# EasyEDA Pro project ProPrj_电路原理图和PCB图1_2024-08-20.epro

# Schematic Schematic2_1
Board Name: Board2_1; Create Date: 2024-08-20; Page Name: P1_1; Project Name: 电路原理图和PCB图1; Schematic Name: Schematic2_1; Update Date: 2024-08-20
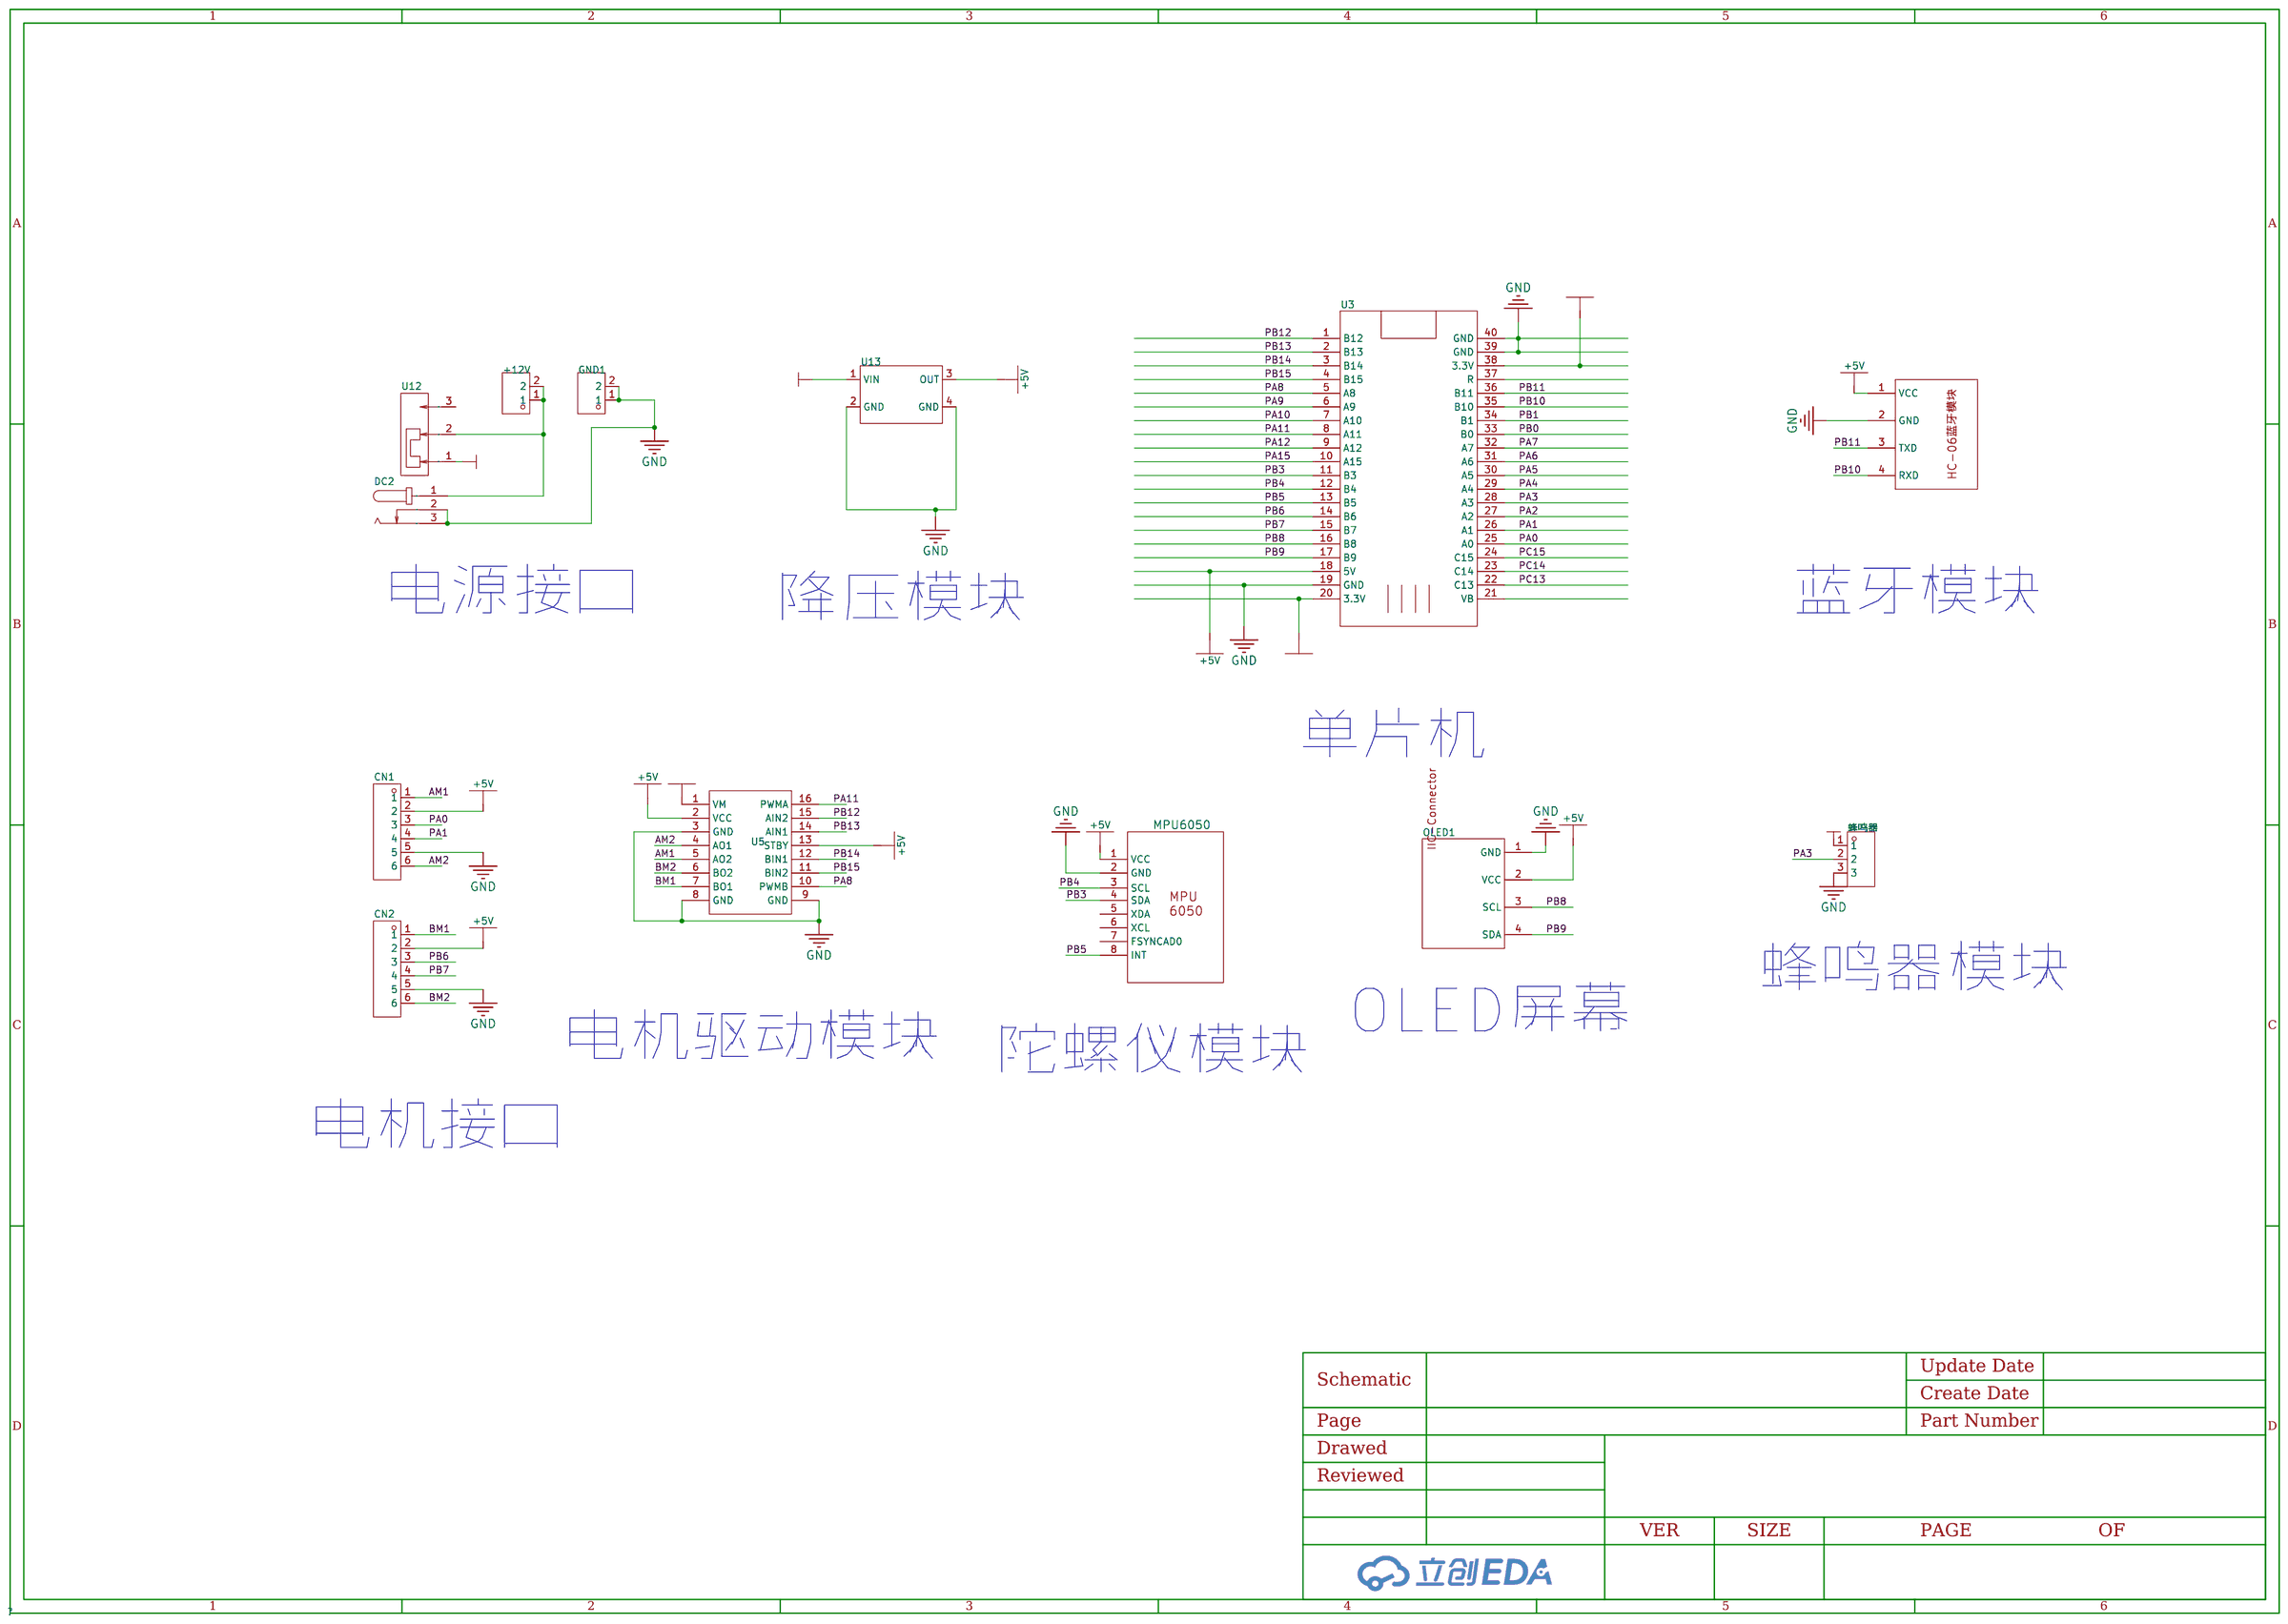
[diagram p0: schematic sheet]

## Parts
+12V  -  [HDR-TH_2P-P2.54-V]
CN1  PH2.0-6P  [PH2.0-6P 直针端子座]
CN2  PH2.0-6P  [PH2.0-6P 直针端子座]
DC2  -  [DC-IN-TH_KH-DC-005-2.5]
GND1  -  [HDR-TH_2P-P2.54-V]
OLED1  -  [0.96OLED_4P]
P1  MPU6050  [MPU6050]
U3  -  [STM32F103C8T6核心板]
U5  -  [TB6612FNG Module - 8pin x 2]
U6  蓝牙模块HC-06  [DIP-1X4P2.54（HC-06蓝牙模块）]
U12  SS-12D10-G5  [SW-TH_SS-12D10-G050]
U13  -  [MP1584模块]
蜂鸣器  -  [HDR-TH_3P-P2.54-V-F]

## Library data of the parts
+12V GND1 = 排针2P: 2.54 1*2P 直排针 0.8u镀金 PBT RoHS,针长3*6mm; Supplier Part: C152154; Manufacturer: Nextron(台湾正凌); Manufacturer Part: Z-211-0211-0021-001; LCSC On Sale: 1; Supplier Footprint: Through Hole,P=2.54mm; JLCPCB Part Class: Extended Part; JLCPCB Stock Number: 5280; Datasheet: https://atta.szlcsc.com/upload/public/pdf/source/20171225/C152154_15141883746031203216.pdf; Supplier: LCSC; Number of Positions: 2; Connector Type: 排针; Number of Rows: 1; Mounting Type: 通孔; Contact Type: 公形引脚; Pitch: 0.100; Contact Material: 黄铜
CN1 CN2 = PH2.0-6P: Pin Type: IN; Supplier: LCSC; Supplier Part: C722763; Manufacturer: CAX(创都); Manufacturer Part: PH2.0-4P; JLCPCB Part Class: Extended Part
DC2 = KH-DC-005-2.5: 连接器类型:DC电源插座;安装方式:弯插;触点内径:-;触点外径:6.4mm;额定电流:1A;额定电压:30V;工作温度范围:-25~+70;; LCSC Part Name: DC电源插座 外径:6.4mm; Supplier Part: C2847170; Manufacturer: kinghelm(金航标); Supplier Footprint: 插件; JLCPCB Part Class: Extended Part; Datasheet: https://atta.szlcsc.com/upload/public/pdf/source/20210716/C2847170_7F0110A0BEDEE81C68B76DF87AC8DA16.pdf; Supplier: LCSC; Connector Type: DC电源插座; Mounting Style: 弯插; Outside Contact Diameter: 6.4mm; Current Rating (Max): 1A; Voltage Rating (Max): 30V; Operating Temperature Range: -25~+70
OLED1 = 0.96OLED_4P: LCSC Part Name: 0.96OLED_4P_MODULE_JX; Supplier Part: C9900004566; Manufacturer Part: 0.96OLED_4P_MODULE_JX; Supplier Footprint: THrough hole; JLCPCB Part Class: Extended Part; Supplier: LCSC
P1 = MPU6050
U3 = stm32f103c8t6最小系统板
U5 = TB6612FNG模块: Pin Type: In
U6 = 蓝牙模块HC-06: Pin Type: IN
U12 = SS-12D10-G5: 电路结构:单刀双掷;安装方式:直插;开关颜色:黑色;滑钮形状:矩形柱状;引脚样式:PC引脚;开关长度:12.7mm;开关宽度:6.7mm;开关高度:11.3mm;; LCSC Part Name: 插件大电流拨动开关; Supplier Part: C2998777; Manufacturer: DEALON(德艺隆); Supplier Footprint: 插件; JLCPCB Part Class: Extended Part; Datasheet: https://atta.szlcsc.com/upload/public/pdf/source/20220428/E10CB334ACBAF32CF4AF8D87DA871CD3.pdf; Supplier: LCSC; Circuit: 单刀双掷; Mounting Style: 直插; Actuator Color: 黑色; Actuator Style: 矩形柱状; Pin Style: PC引脚; Switch Length: 12.7mm; Switch Width: 6.7mm; Switch Height: 11.3mm
U13 = MP1584模块: Pin Type: IN
蜂鸣器 = HDR-F_2.54_1x3P: Supplier Part: C541850; Supplier Footprint: 插件

## Nets
+3.3V: U3.20(3.3V) U3.38(3.3V)
+5V: CN1.2 CN2.2 OLED1.2(VCC) P1.1(VCC) U3.18(5V) U5.2(VCC) U5.13(STBY) U6.1(VCC) U13.3(OUT) 蜂鸣器.1
+12V: U5.1(VM) U12.1 U13.1(VIN)
GND: CN1.5 CN2.5 DC2.2 DC2.3 GND1.1 GND1.2 OLED1.1(GND) P1.2(GND) U3.19(GND) U3.39(GND) U3.40(GND) U5.3(GND) U5.8(GND) U5.9(GND) U6.2(GND) U13.2(GND) U13.4(GND) 蜂鸣器.3
AM1: CN1.1 U5.5(AO2)
AM2: CN1.6 U5.4(AO1)
BM1: CN2.1 U5.7(BO1)
BM2: CN2.6 U5.6(BO2)
PA0: CN1.3 U3.25(A0)
PA1: CN1.4 U3.26(A1)
PA2: U3.27(A2)
PA3: U3.28(A3) 蜂鸣器.2
PA4: U3.29(A4)
PA5: U3.30(A5)
PA6: U3.31(A6)
PA7: U3.32(A7)
PA8: U3.5(A8) U5.10(PWMB)
PA9: U3.6(A9)
PA10: U3.7(A10)
PA11: U3.8(A11) U5.16(PWMA)
PA12: U3.9(A12)
PA15: U3.10(A15)
PB0: U3.33(B0)
PB1: U3.34(B1)
PB3: P1.4(SDA) U3.11(B3)
PB4: P1.3(SCL) U3.12(B4)
PB5: P1.8(INT) U3.13(B5)
PB6: CN2.3 U3.14(B6)
PB7: CN2.4 U3.15(B7)
PB8: OLED1.3(SCL) U3.16(B8)
PB9: OLED1.4(SDA) U3.17(B9)
PB10: U3.35(B10) U6.4(RXD)
PB11: U3.36(B11) U6.3(TXD)
PB12: U3.1(B12) U5.15(AIN2)
PB13: U3.2(B13) U5.14(AIN1)
PB14: U3.3(B14) U5.12(BIN1)
PB15: U3.4(B15) U5.11(BIN2)
PC13: U3.22(C13)
PC14: U3.23(C14)
PC15: U3.24(C15)
$3N3363: +12V.1 +12V.2 DC2.1 U12.2

Not connected (* = marked no-connect by the designer): P1 5(XDA) 6(XCL) 7(FSYNCAD0); U3 21(VB) 37(R); U12 3

## Notes on the sheet
- 电源接口
- 降压模块
- 蓝牙模块
- 单片机
- 蜂鸣器模块
- OLED屏幕
- 电机驱动模块
- 陀螺仪模块
- 电机接口

# Board 标准版
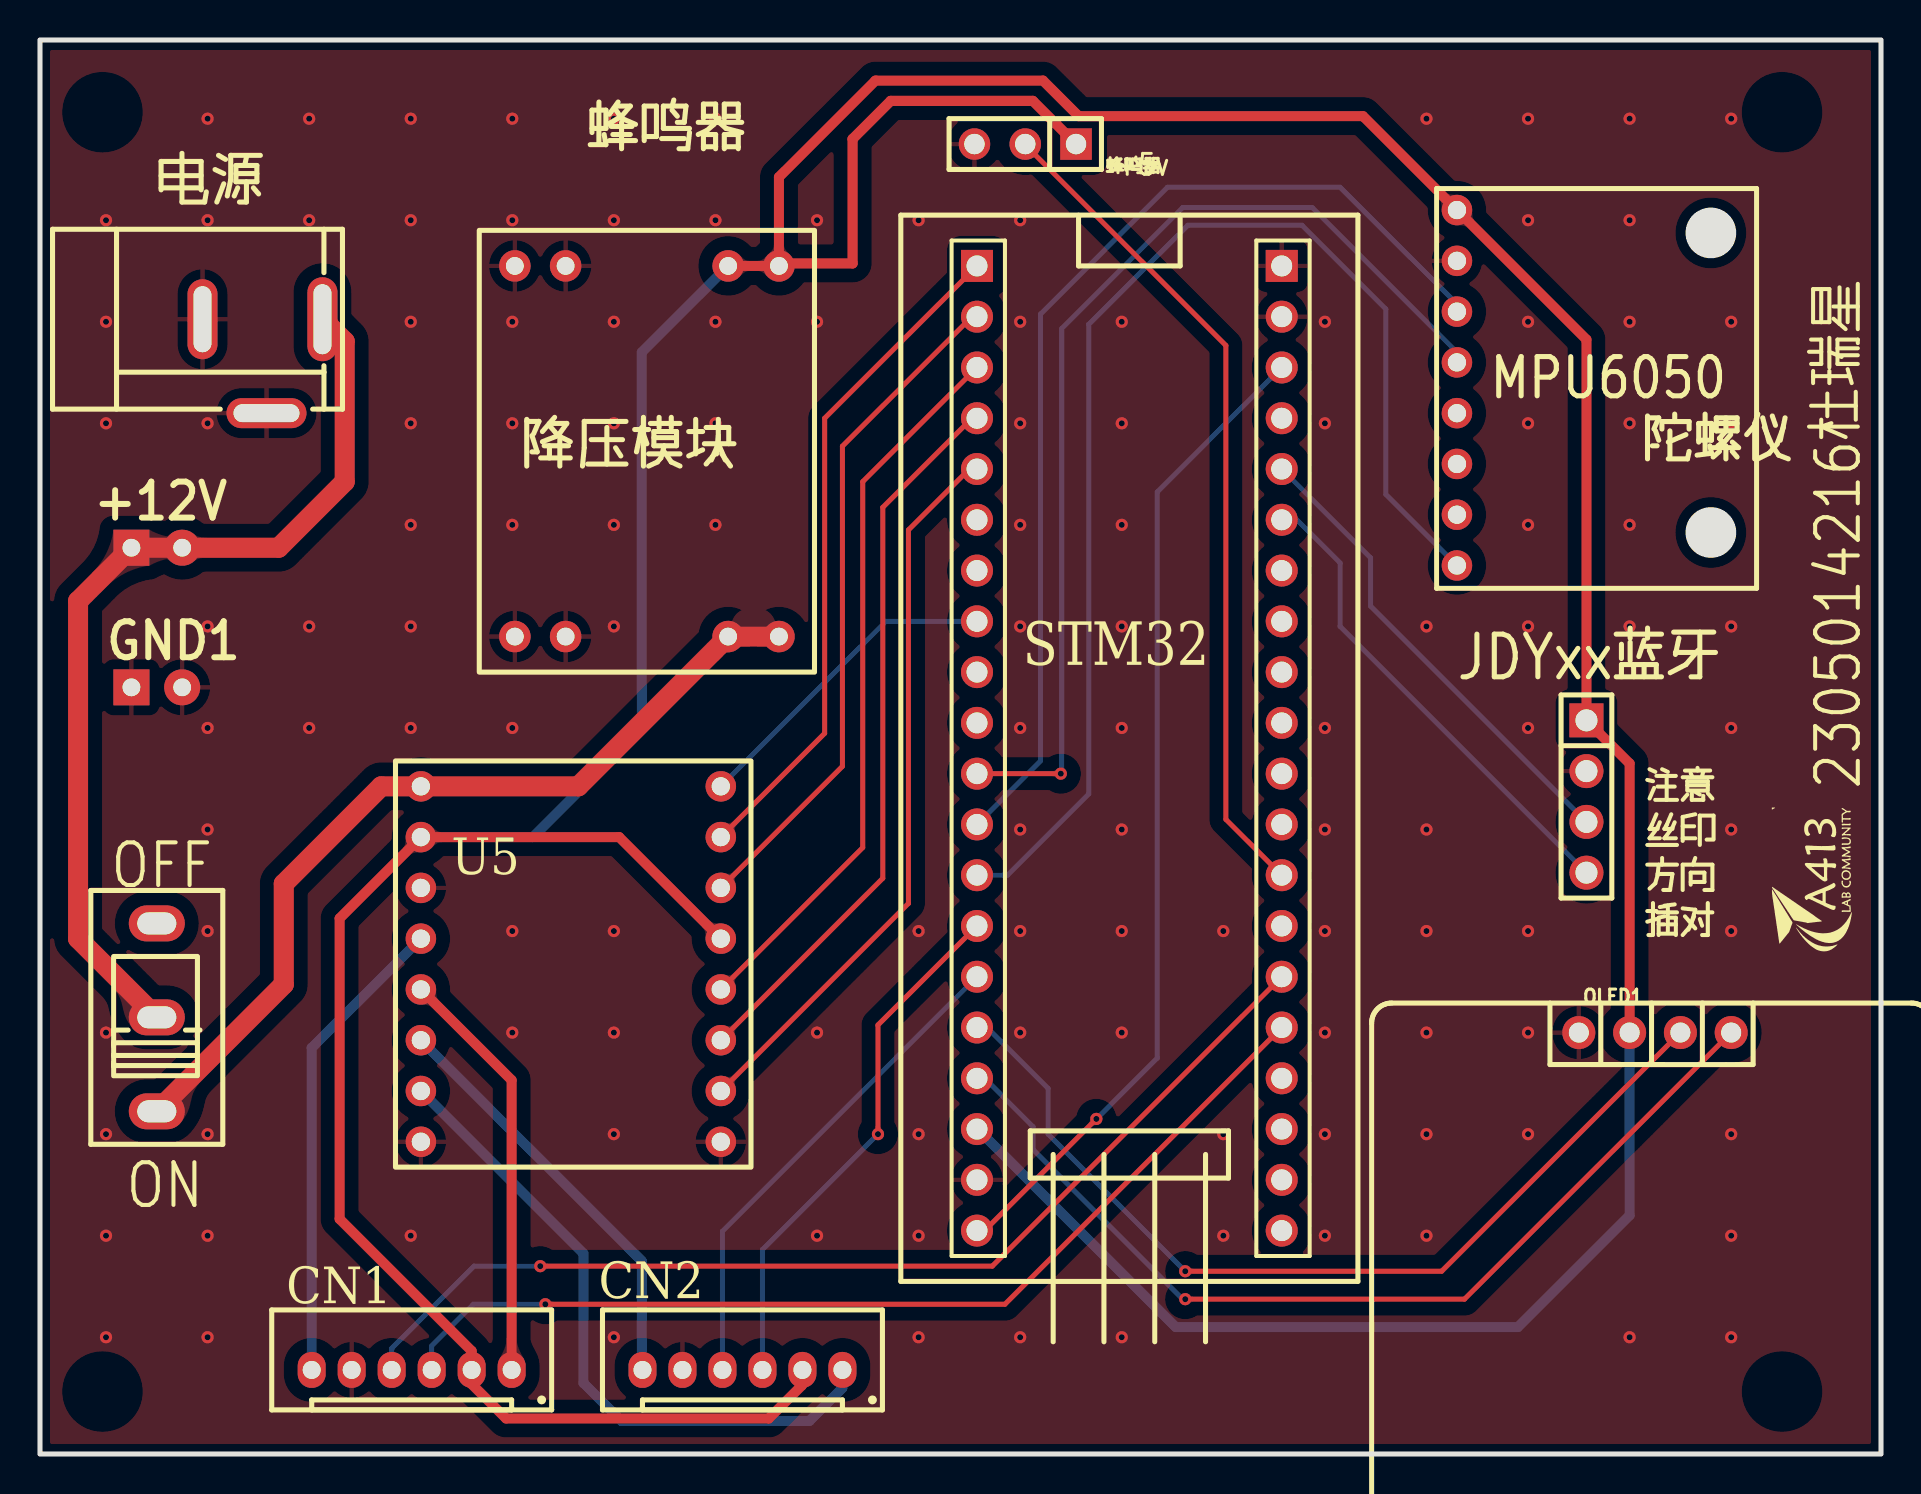
[diagram p1: board, top side]
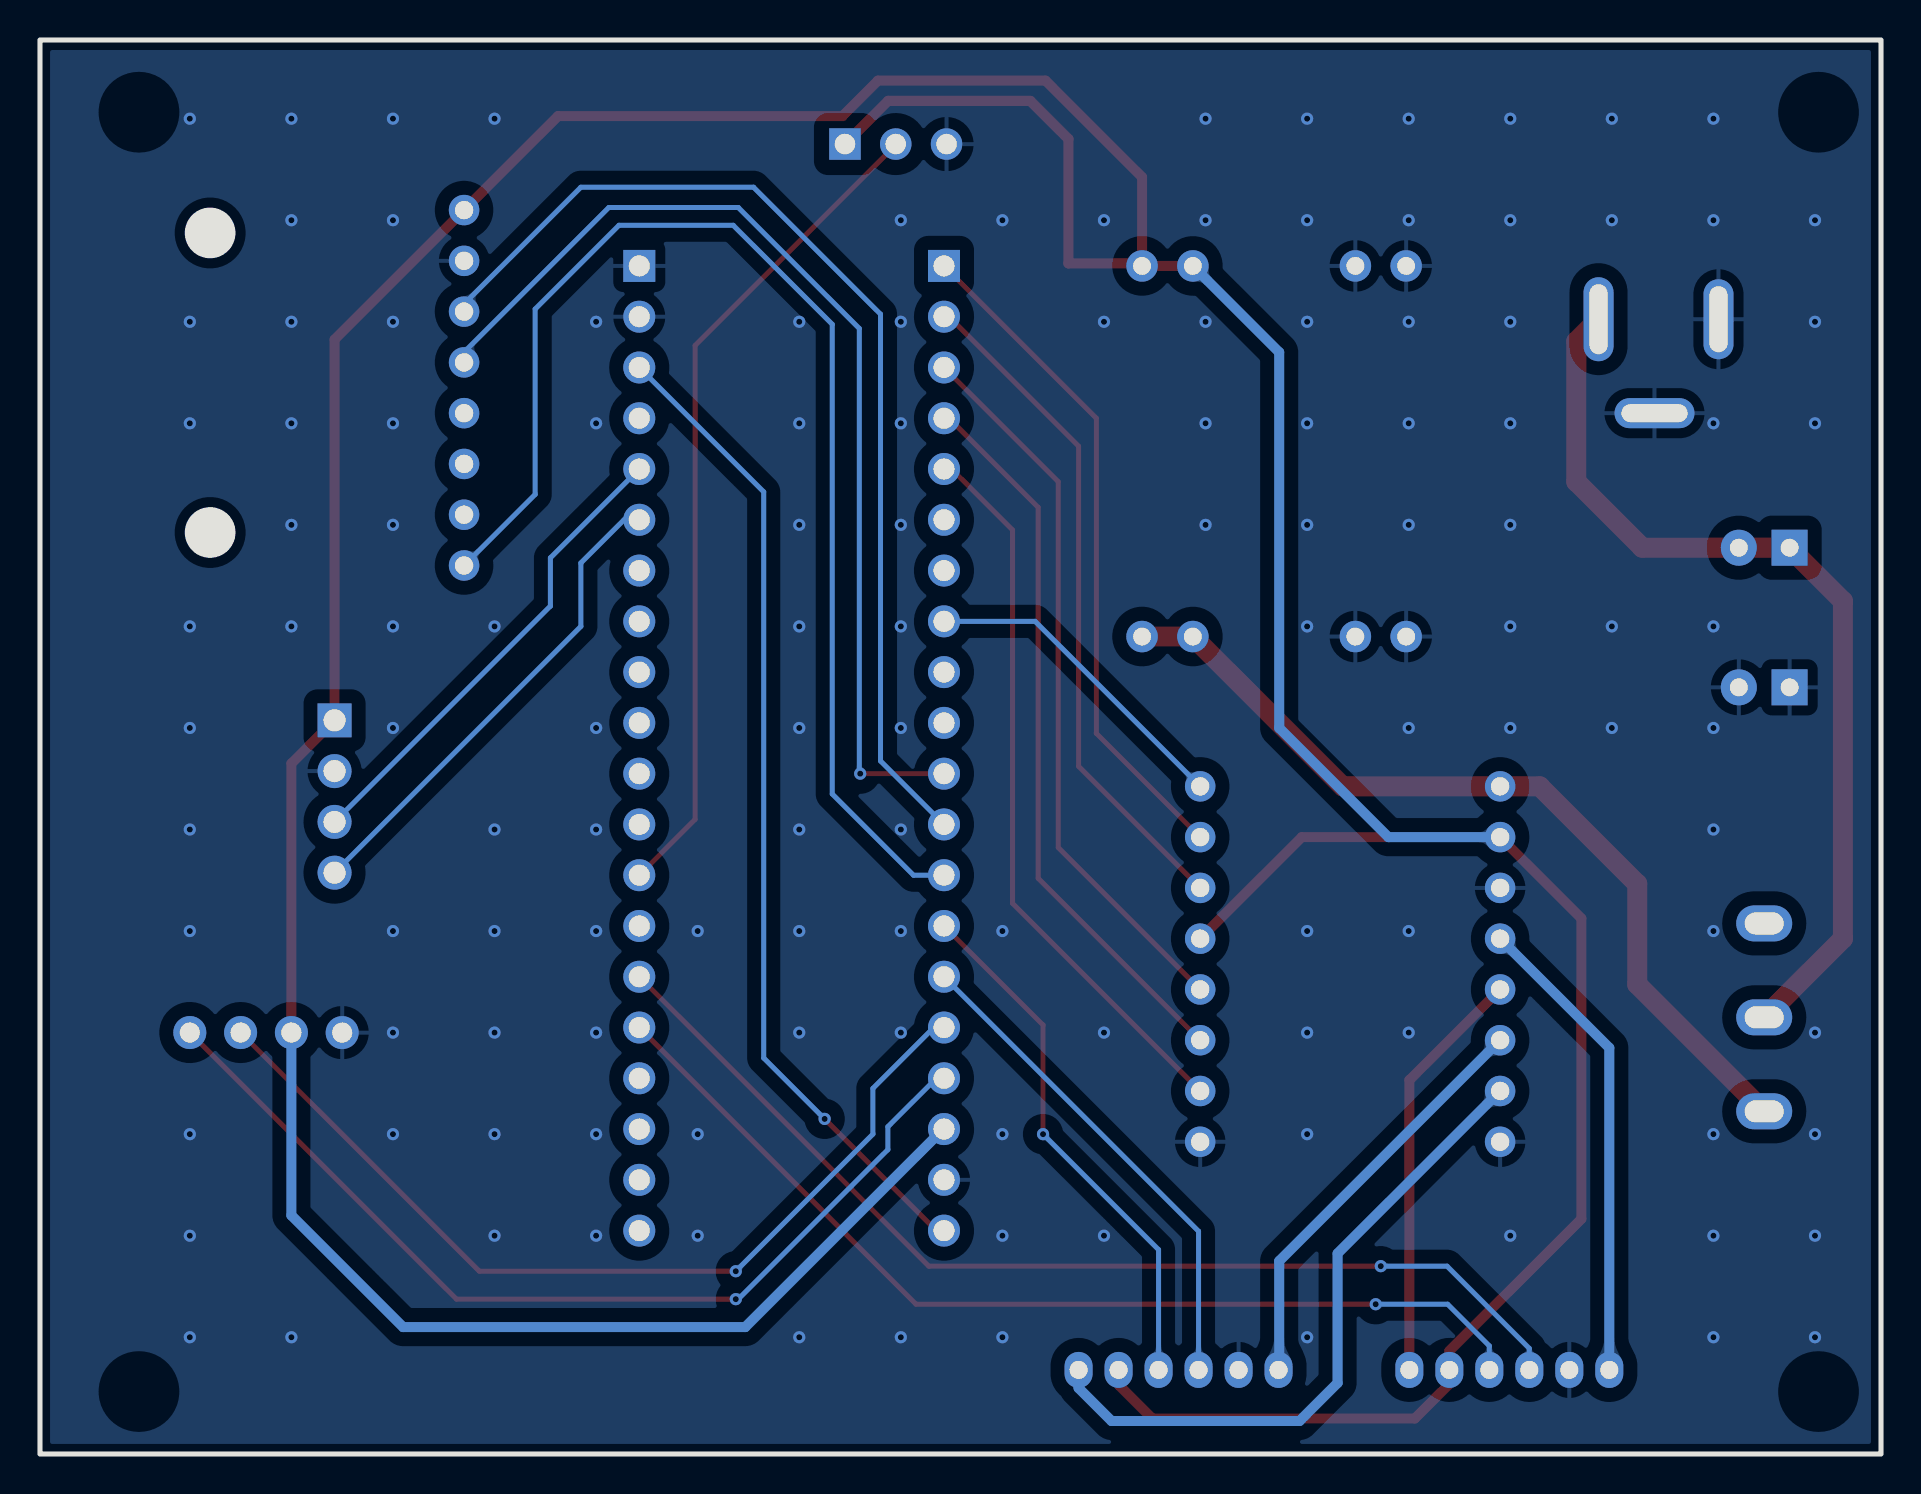
[diagram p2: board, bottom side, seen from below]

Outline 92.07 x 70.74 mm; copper layers: Top Layer, Bottom Layer. Coordinates in mm from the lower left corner of the outline.
Outline path: rectangle 0,70.74 92.07,0
Stack: Top Layer 0.035mm / Dielectric1 1.51mm FR4 er 4.5 / Bottom Layer 0.035mm

## Design rules (mm)
spacing safeClearance (default): track to track 0.152, other pairs 0.152 to 0.3
track width trackWidth (default): min 0.127, default 0.254, max 2.54
differential pair differentialPair (default): width min 0.127, default 0.254, max 2.54; gap min 0.152, default 0.152
via viaSize (default): diameter min 0.5, default 0.61, max 10; hole min 0.3, default 0.305, max 6
template: 用户自定义配置
spacing safeClearance (default): track to track 0.5, other pairs 0.5 to 0.5
track width trackWidth (default): min 0.127, default 0.254, max 2.54
differential pair differentialPair (default): width min 0.127, default 0.254, max 2.54; gap min 0.152, default 0.152
via viaSize (default): diameter min 0.5, default 0.61, max 10; hole min 0.3, default 0.305, max 6

## Placement (name value [footprint] x y rotation side)
+12V  -  [HDR-TH_2P-P2.54-V]  5.84 45.34 0 top
CN1  PH2.0-6P  [PH2.0-6P 直针端子座]  23.59 4.21 180 top
CN2  PH2.0-6P  [PH2.0-6P 直针端子座]  40.13 4.21 180 top
DC2  -  [DC-IN-TH_KH-DC-005-2.5]  11.13 54.42 0 top
GND1  -  [HDR-TH_2P-P2.54-V]  5.84 38.35 0 top
OLED1  -  [0.96OLED_4P]  80.77 21.08 0 top
P1  -  [MPU6050]  69.85 43.31 0 top
U3  -  [STM32F103C8T6核心板]  54.48 35.31 0 top
U5  -  [TB6612FNG Module - 8pin x 2]  26.67 24.51 0 top
U6  蓝牙模块HC-06  [DIP-1X4P2.54（HC-06蓝牙模块）]  77.34 32.89 180 top
U12  SS-12D10-G5  [SW-TH_SS-12D10-G050]  5.84 21.84 90 top
U13  -  [MP1584模块]  30.35 50.17 90 top
蜂鸣器  -  [HDR-TH_3P-P2.54-V-F]  49.28 65.53 180 top

## Footprints (pads in the part's own frame, mm; a bottom-side part is the same pattern mirrored in y, then rotated)
0.96OLED_4P
  round 1.651 hole 1.001: 1(-3.81,0) 2(-1.27,0.003) 3(1.27,0.003) 4(3.81,0.003)
DC-IN-TH_KH-DC-005-2.5
  oval 1.501x4.201 hole 0.899x3.5: 1(2.999,2.349)
  oval 1.501x4 hole 0.899x3.3: 2(-2.999,2.349)
  oval 4x1.501 hole 3.3x0.899: 3(0.201,-2.349)
DIP-1X4P2.54（HC-06蓝牙模块）
  rect 1.7x1.7 hole 1.1: 1(0,-3.81)
  round 1.7 hole 1.1: 2(0,-1.27) 3(0,1.27) 4(0,3.81)
HDR-TH_2P-P2.54-V
  rect 1.801x1.801 hole 0.889: 1(-1.27,0)
  round 1.801 hole 0.889: 2(1.27,0)
HDR-TH_3P-P2.54-V-F
  rect 1.575x1.575 hole 1.02: 1(-2.54,0)
  round 1.575 hole 1.02: 2(0,0) 3(2.54,0)
MP1584模块
  round 1.575 hole 0.889: 1(-9.271,-4.064) 1(-9.271,-6.604) 2(-9.271,6.604) 2(-9.271,4.064) 3(9.271,-4.064) 3(9.271,-6.604) 4(9.271,6.604) 4(9.271,4.064)
MPU6050
  round 1.524 hole 0.914: 1(1.016,18.923) 2(1.016,16.383) 3(1.016,13.843) 4(1.016,11.303) 5(1.016,8.763) 6(1.016,6.223) 7(1.016,3.683) 8(1.016,1.143)
PH2.0-6P 直针端子座
  oval 1.4x1.8 hole 0.9: 1(0,0) 2(2,0) 3(4,0) 4(6,0) 5(8,0) 6(10,0)
STM32F103C8T6核心板
  rect 1.6x1.6 hole 1.049: 1(-7.62,24.13) 40(7.62,24.13)
  round 1.6 hole 1.049: 2(-7.62,21.59) 3(-7.62,19.05) 4(-7.62,16.51) 5(-7.62,13.97) 6(-7.62,11.43) 7(-7.62,8.89) 8(-7.62,6.35) 9(-7.62,3.81) 10(-7.62,1.27) 11(-7.62,-1.27) 12(-7.62,-3.81) 13(-7.62,-6.35) 14(-7.62,-8.89) 15(-7.62,-11.43) 16(-7.62,-13.97) 17(-7.62,-16.51) 18(-7.62,-19.05) 19(-7.62,-21.59) 20(-7.62,-24.13) 21(7.62,-24.13) 22(7.62,-21.59) 23(7.62,-19.05) 24(7.62,-16.51) 25(7.62,-13.97) 26(7.62,-11.43) 27(7.62,-8.89) 28(7.62,-6.35) 29(7.62,-3.81) 30(7.62,-1.27) 31(7.62,1.27) 32(7.62,3.81) 33(7.62,6.35) 34(7.62,8.89) 35(7.62,11.43) 36(7.62,13.97) 37(7.62,16.51) 38(7.62,19.05) 39(7.62,21.59)
SW-TH_SS-12D10-G050
  oval 1.8x2.8 hole 1.1x1.95: 1(-4.7,0) 2(0,0) 3(4.7,0)
TB6612FNG Module - 8pin x 2
  round 1.524 hole 0.914: 1(-7.62,8.89) 2(-7.62,6.35) 3(-7.62,3.81) 4(-7.62,1.27) 5(-7.62,-1.27) 6(-7.62,-3.81) 7(-7.62,-6.35) 8(-7.62,-8.89) 9(7.38,-8.89) 10(7.38,-6.35) 11(7.38,-3.81) 12(7.38,-1.27) 13(7.38,1.27) 14(7.38,3.81) 15(7.38,6.35) 16(7.38,8.89)

## Nets
As in the schematic.

Pads without a net: P1 5 6 7; U12 3

## Via types
v1: diameter 0.61, hole 0.304, Top Layer to Bottom Layer, 125 vias
v2: diameter 0.61, hole 0.305, Top Layer to Bottom Layer, 7 vias

## Routing (per net, layer and track width the routed paths; a pad name or vN(x,y) marks a point on that pad's centre or on a via; arc(x,y) is an arc through that point)
+3.3V: length 49.7
  Top Layer w0.25: v2(52.83,16.76) 47.24,11.18 U3.20
  Bottom Layer w0.25: v2(52.83,16.76) 55.88,19.81 55.88,48.13 U3.38
+5V: length 267.1
  Top Layer w0.5: U5.13 28.97,30.86 U5.2 14.99,26.8 14.99,11.76 21.59,5.15 CN1.2 21.59,3.5 23.31,1.78 36.45,1.78 38.1,3.43 38.1,4.18 CN2.2 ; U13.3 36.96,59.44 36.96,63.88 41.78,68.71 50.16,68.71 51.94,66.93 66.17,66.93 P1.1 77.34,55.75 U6.1 79.5,34.54 OLED1.2
  Top Layer w0.508: 36.96,59.44 37.08,59.56 40.64,59.56 40.64,65.79 42.54,67.69 49.66,67.69 蜂鸣器.1
  Bottom Layer w0.5: OLED1.2 79.5,11.94 73.91,6.35 56.8,6.35 46.9,16.26 U3.18 ; U13.3 30.1,55.12 30.1,36.32 24.64,30.86 U5.2
+12V: length 43.9
  Top Layer w1: 36.96,40.89 U13.1 26.92,33.4 U5.1 17.07,33.4 12.19,28.53 12.19,23.49 U12.1
GND:
  vias: v1(3.3,61.72) v1(3.3,56.64) v1(3.3,51.56) v1(3.3,21.08) v1(3.3,16) v1(3.3,10.92) v1(3.3,5.84) v1(8.38,66.8) v1(8.38,61.72) v1(8.38,51.56) v1(8.38,41.4) v1(8.38,36.32) v1(8.38,31.24) v1(8.38,26.16) v1(8.38,16) v1(8.38,10.92) v1(8.38,5.84) v1(13.46,66.8) v1(13.46,61.72) v1(13.46,41.4) v1(13.46,36.32) v1(18.54,66.8) v1(18.54,61.72) v1(18.54,56.64) v1(18.54,51.56) v1(18.54,46.48) v1(18.54,41.4) v1(18.54,36.32) v1(18.54,10.92) v1(23.62,66.8) v1(23.62,61.72) v1(23.62,56.64) v1(23.62,51.56) v1(23.62,46.48) v1(23.62,36.32) v1(23.62,26.16) v1(23.62,21.08) v1(28.7,66.8) v1(28.7,61.72) v1(28.7,56.64) v1(28.7,51.56) v1(28.7,46.48) v1(28.7,41.4) v1(28.7,26.16) v1(28.7,21.08) v1(28.7,16) v1(28.7,5.84) v1(33.78,66.8) v1(33.78,61.72) v1(33.78,56.64) v1(33.78,51.56) v1(33.78,46.48) v1(38.86,61.72) v1(38.86,56.64) v1(38.86,21.08) v1(38.86,10.92) v1(43.94,61.72) v1(43.94,26.16) v1(43.94,16) v1(43.94,10.92) v1(43.94,5.84) v1(49.02,61.72) v1(49.02,56.64) v1(49.02,51.56) v1(49.02,46.48) v1(49.02,41.4) v1(49.02,36.32) v1(49.02,31.24) v1(49.02,26.16) v1(49.02,21.08) v1(49.02,5.84) v1(54.1,56.64) v1(54.1,51.56) v1(54.1,46.48) v1(54.1,41.4) v1(54.1,36.32) v1(54.1,31.24) v1(54.1,26.16) v1(54.1,21.08) v1(54.1,5.84) v1(59.18,26.16) v1(59.18,16) v1(59.18,10.92) v1(64.26,56.64) v1(64.26,51.56) v1(64.26,36.32) v1(64.26,31.24) v1(64.26,26.16) v1(64.26,21.08) v1(64.26,16) v1(64.26,10.92) v1(69.34,66.8) v1(69.34,41.4) v1(69.34,31.24) v1(69.34,26.16) v1(69.34,21.08) v1(69.34,16) v1(69.34,10.92) v1(74.42,66.8) v1(74.42,61.72) v1(74.42,56.64) v1(74.42,51.56) v1(74.42,46.48) v1(74.42,41.4) v1(74.42,36.32) v1(74.42,26.16) v1(74.42,21.08) v1(74.42,16) v1(79.5,66.8) v1(79.5,61.72) v1(79.5,56.64) v1(79.5,51.56) v1(79.5,46.48) v1(79.5,41.4) v1(79.5,5.84) v1(84.58,66.8) v1(84.58,56.64) v1(84.58,51.56) v1(84.58,41.4) v1(84.58,36.32) v1(84.58,31.24) v1(84.58,26.16) v1(84.58,16) v1(84.58,10.92) v1(84.58,5.84)
AM1: length 20.9
  Top Layer w0.5: U5.5 23.59,18.7 CN1.1
AM2: length 23.8
  Bottom Layer w0.5: U5.4 13.59,20.32 CN1.6
BM1: length 33.3
  Bottom Layer w0.5: CN2.1 40.13,3.3 38.48,1.65 29.08,1.65 27.18,3.56 27.18,10.03 U5.7
BM2: length 21.1
  Bottom Layer w0.5: CN2.6 30.1,4.24 30.1,9.65 U5.6
PA0: length 50.3
  Top Layer w0.25: v2(25.27,7.49) 48.26,7.49 U3.25
  Bottom Layer w0.25: CN1.3 19.59,5.41 21.67,7.49 v2(25.27,7.49)
PA1: length 53.3
  Top Layer w0.25: U3.26 47.62,9.4 v2(25.02,9.4)
  Bottom Layer w0.25: v2(25.02,9.4) 21.7,9.4 17.59,5.28 CN1.4
PA3: length 41.7
  Top Layer w0.25: 49.4,65.41 49.4,65.36 59.31,55.45 59.31,31.75 U3.28
PA8: length 36.6
  Top Layer w0.25: U5.10 43.43,27.55 43.43,46.23 46.48,49.28 U3.5
PA11: length 16.2
  Bottom Layer w0.25: U3.8 42.31,41.66 U5.16
PB3: length 52.3
  Top Layer w0.25: v2(51.05,34.04) U3.11
  Bottom Layer w0.25: v2(51.05,34.04) 51.1,34.08 51.1,56.3 57.15,62.36 63.63,62.36 70.87,55.12 P1.4
PB4: length 53.1
  Bottom Layer w0.25: U3.12 50.04,34.67 50.04,57.02 56.39,63.37 65.02,63.37 70.87,57.53 P1.3
PB5: length 63.7
  Bottom Layer w0.25: U3.13 48.39,28.96 52.45,33.02 52.45,56.52 57.4,61.47 63.12,61.47 67.31,57.28 67.31,48.01 P1.8
PB6: length 26.7
  Top Layer w0.25: U3.14 41.91,21.46 v2(41.91,16)
  Bottom Layer w0.25: v2(41.91,16) 36.13,10.22 CN2.3
PB7: length 24.9
  Bottom Layer w0.25: CN2.4 34.13,11.15 U3.15
PB8: length 46.5
  Top Layer w0.25: OLED1.3 70.1,9.14 v2(57.28,9.14)
  Bottom Layer w0.25: U3.16 47.37,21.34 50.42,18.29 50.42,16 v2(57.28,9.14)
PB9: length 48.5
  Top Layer w0.25: OLED1.4 71.24,7.75 v2(57.28,7.75)
  Bottom Layer w0.25: U3.17 47.24,18.8 49.67,16.37 49.67,15.23 57.15,7.75 v2(57.28,7.75)
PB10: length 24.4
  Bottom Layer w0.25: U3.35 62.87,46.74 65.02,44.58 65.02,41.4 U6.4
PB11: length 24
  Bottom Layer w0.25: U3.36 66.55,44.83 66.55,42.42 U6.3
PB12: length 33.9
  Top Layer w0.25: U3.1 39.24,51.82 39.24,36.05 U5.15
PB13: length 34
  Top Layer w0.25: U3.2 46.61,56.9 40.13,50.42 40.13,34.4 U5.14
PB14: length 36.4
  Top Layer w0.25: U5.12 41.15,30.34 41.15,48.64 U3.3
PB15: length 36.6
  Top Layer w0.25: U5.11 42.15,28.8 42.15,47.36 46.61,51.82 U3.4
$3N3363: length 46.9
  Top Layer w1: DC2.1 15.24,55.66 15.24,48.64 11.94,45.34 +12V.2 +12V.1 1.91,42.67 1.91,25.78 U12.2

## Copper pours and planes (outline as drawn; the poured copper is in the pictures)
GND on Top Layer: 0,70.74 92.07,70.74 92.07,0 0,0
GND on Top Layer: 0,79.88 98.93,79.88 98.93,0 0,0
GND on Bottom Layer: 0,70.74 92.07,70.74 92.07,0 0,0
GND on Bottom Layer: -131.95,88.82 -31.95,88.82 -31.95,-11.18 -131.95,-11.18
GND on Bottom Layer: 164.21,68.96 261.11,68.96 261.11,-6.35 164.21,-6.35
GND on Bottom Layer: 179.58,115.24 279.58,115.24 279.58,15.49 179.58,15.49

Small or netless copper shapes (teardrops, artwork), in the pictures only: 37 on Top Layer, 23 on Bottom Layer

## Text on the board
Top Silkscreen Layer: +5v | OFF | ON | 注意 / 丝印 / 方向 / 插对 | 2305014216杜瑞星 | MPU6050 / 陀螺仪 | 电源 | 降压模块 | 蜂鸣器 | STM32 | JDYxx蓝牙
